# Altium project motordriver-v3.0.PrjPCB
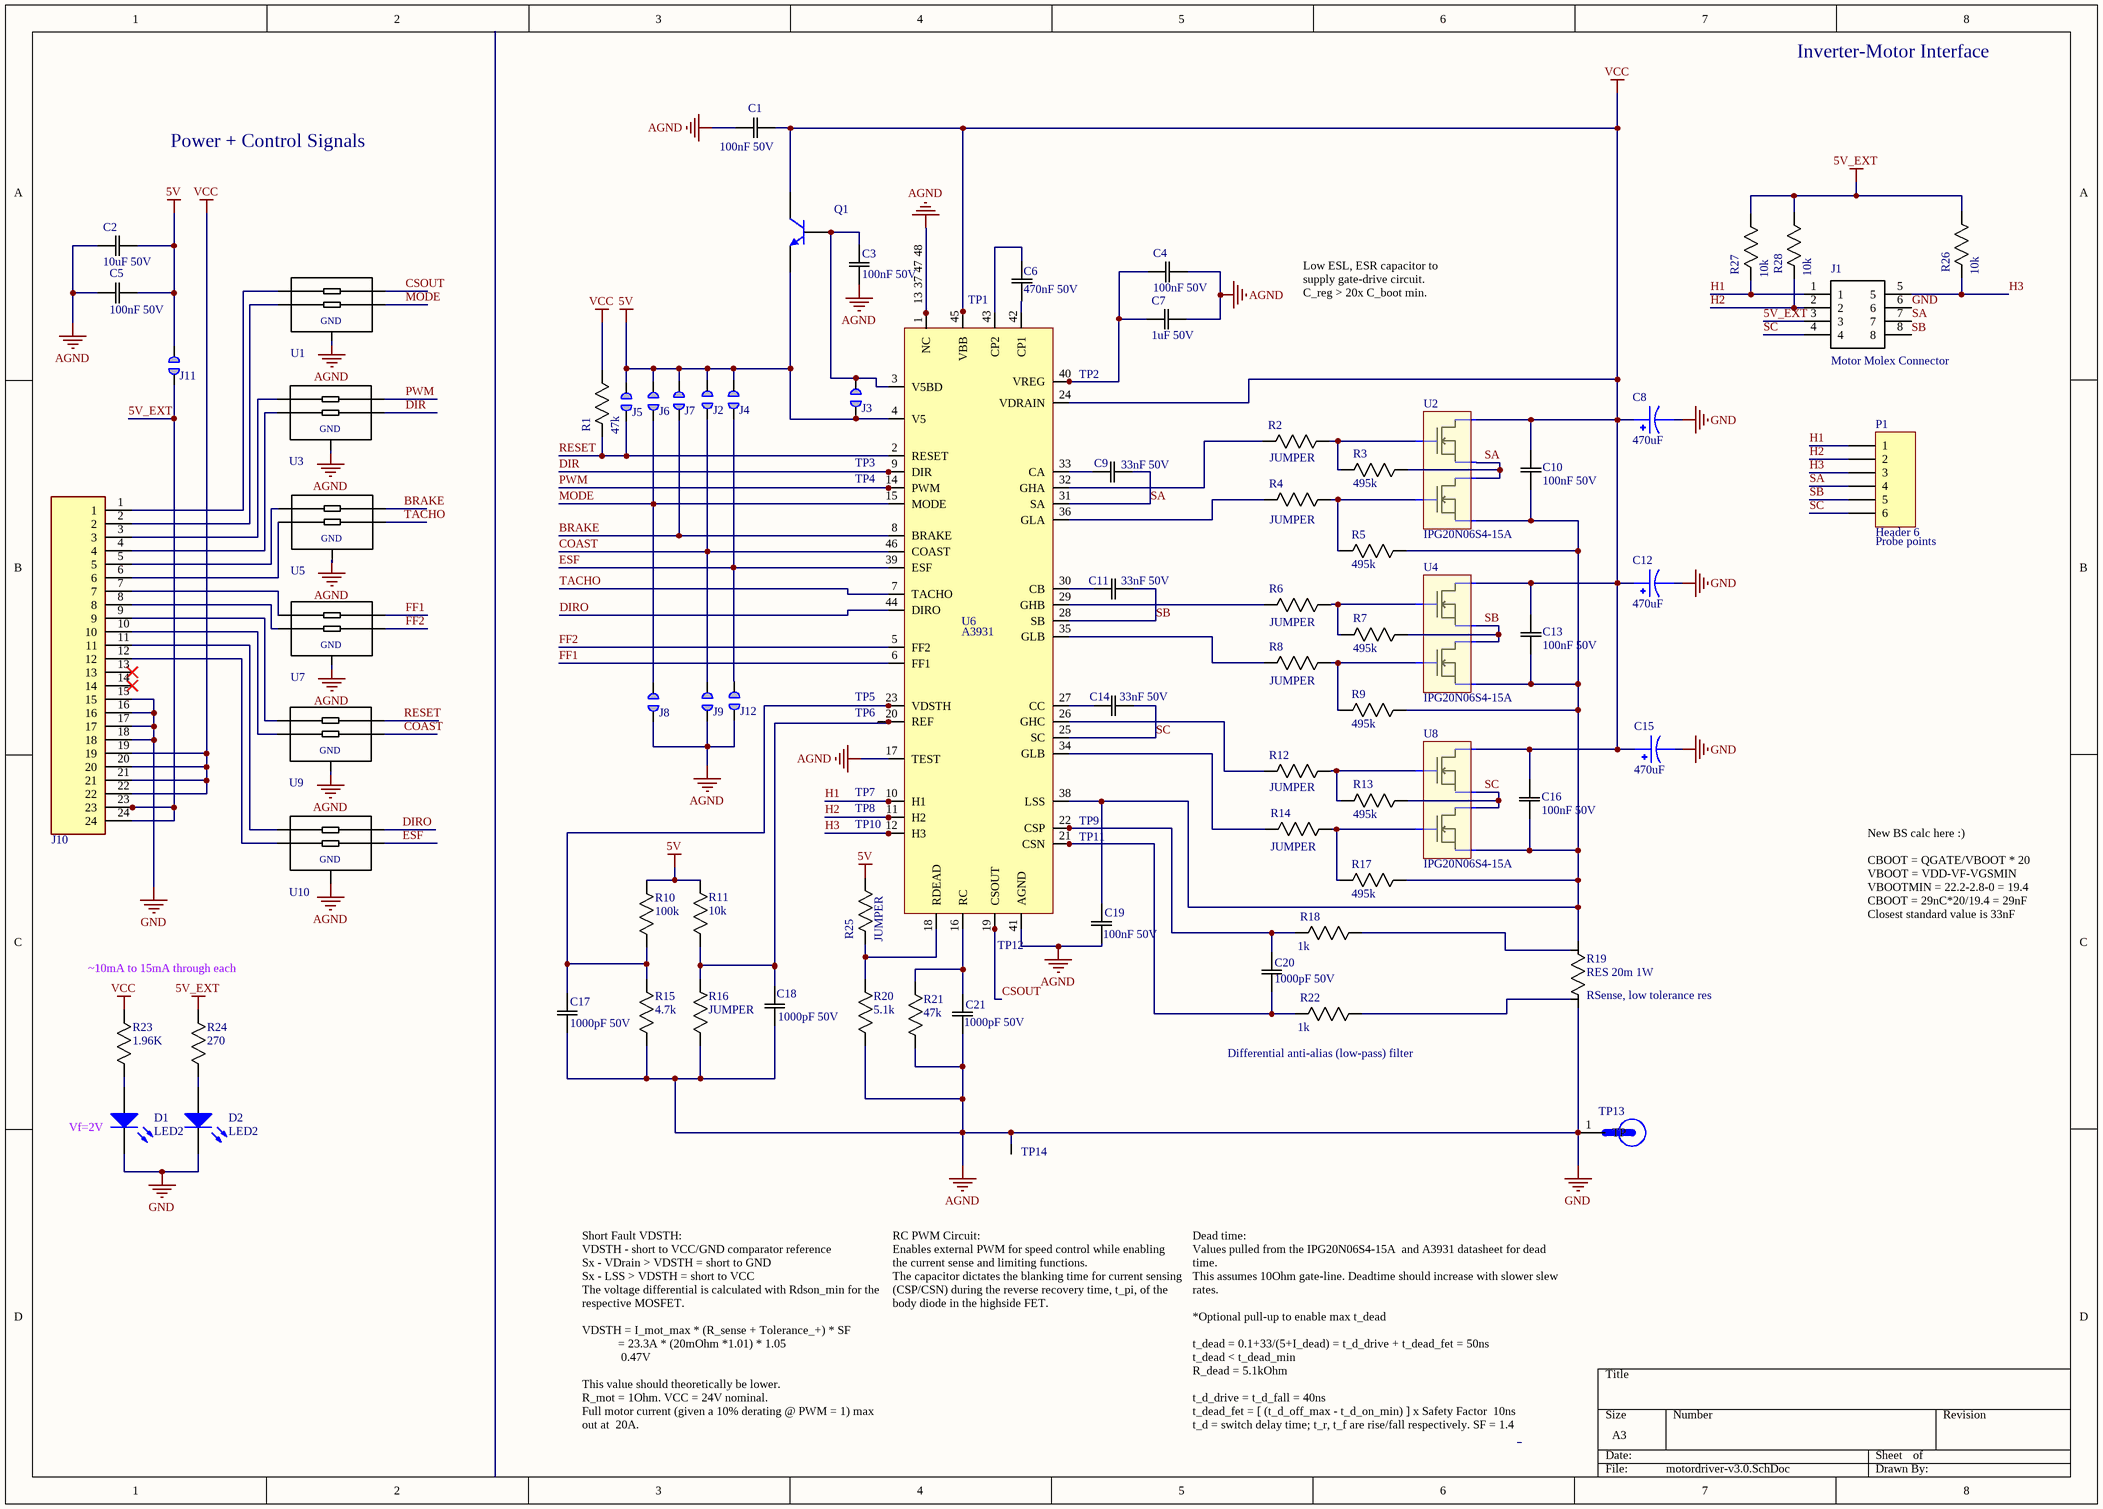
[diagram p0: motordriver-v3.0.SchDoc]
1 sheet, 89 parts. Net scope: global (net labels, ports and power ports of the same name join across sheets).
Board file: motordriver-v3.0.PcbDoc

## Sheet motordriver-v3.0.SchDoc
size A3

### Parts
C1  100nF 50V  [0805]
C2  10uF 50V  [0805]
C3  100nF 50V  [0805]
C4  100nF 50V  [0805]
C5  100nF 50V  [0805]
C6  470nF 50V  [0805]
C7  1uF 50V  [0805]
C8  470uF  [CAPAE1350X1400N_EEV-FK1V471Q]
C9  33nF 50V  [0805]
C10  100nF 50V  [0805]
C11  33nF 50V  [0805]
C12  470uF  [CAPAE1350X1400N_EEV-FK1V471Q]
C13  100nF 50V  [0805]
C14  33nF 50V  [0805]
C15  470uF  [CAPAE1350X1400N_EEV-FK1V471Q]
C16  100nF 50V  [0805]
C17  1000pF 50V  [0805]
C18  1000pF 50V  [0805]
C19  100nF 50V  [0805]
C20  1000pF 50V  [0805]
C21  1000pF 50V  [0805]
D1  LED2  [3.2X1.6X1.1]
D2  LED2  [3.2X1.6X1.1]
J1  Motor Molex Connector  [MOLEX_0039281083]
J2  Jumper (0805 Compatible)  [Solder Jumper]  (value not drawn)
J3  Jumper (0805 Compatible)  [Solder Jumper]  (value not drawn)
J4  Jumper (0805 Compatible)  [Solder Jumper]  (value not drawn)
J5  Jumper (0805 Compatible)  [Solder Jumper]  (value not drawn)
J6  Jumper (0805 Compatible)  [Solder Jumper]  (value not drawn)
J7  Jumper (0805 Compatible)  [Solder Jumper]  (value not drawn)
J8  Jumper (0805 Compatible)  [Solder Jumper]  (value not drawn)
J9  Jumper (0805 Compatible)  [Solder Jumper]  (value not drawn)
J10  CN HDR 24POS 2x12  [CN Header 24 POS (12x2)]  (value not drawn)
J11  Jumper (0805 Compatible)  [Solder Jumper]  (value not drawn)
J12  Jumper (0805 Compatible)  [Solder Jumper]  (value not drawn)
P1  Header 6  [HDR1X6]
Q1  N-BJT BCP54  [*SOT230P700X180-4N]  (value not drawn)
R1  47k  [0805]
R2  JUMPER  [0805]
R3  495k  [0805]
R4  JUMPER  [0805]
R5  495k  [0805]
R6  JUMPER  [0805]
R7  495k  [0805]
R8  JUMPER  [0805]
R9  495k  [0805]
R10  100k  [0805]
R11  10k  [0805]
R12  JUMPER  [0805]
R13  495k  [0805]
R14  JUMPER  [0805]
R15  4.7k  [0805]
R16  JUMPER  [0805]
R17  495k  [0805]
R18  1k  [0805]
R19  RES 20m 1W  [1206 - Sense]
R20  5.1k  [0805]
R21  47k  [0805]
R22  1k  [0805]
R23  1.96K  [0805]
R24  270  [0805]
R25  JUMPER  [0805]
R26  10k  [0805]
R27  10k  [0805]
R28  10k  [0805]
TP1  Test Point (Via)  [TP]  (value not drawn)
TP2  Test Point (Via)  [TP]  (value not drawn)
TP3  Test Point (Via)  [TP]  (value not drawn)
TP4  Test Point (Via)  [TP]  (value not drawn)
TP5  Test Point (Via)  [TP]  (value not drawn)
TP6  Test Point (Via)  [TP]  (value not drawn)
TP7  Test Point (Via)  [TP]  (value not drawn)
TP8  Test Point (Via)  [TP]  (value not drawn)
TP9  Test Point (Via)  [TP]  (value not drawn)
TP10  Test Point (Via)  [TP]  (value not drawn)
TP11  Test Point (Via)  [TP]  (value not drawn)
TP12  Test Point (Via)  [TP]  (value not drawn)
TP13  Test Point - 5019  [TP380X203]  (value not drawn)
TP14  Test Point (Via)  [TP]  (value not drawn)
U1  EMI  [SOT-665]  (value not drawn)
U2  IPG20N06S4-15A  [PG-TDSON-8-10]
U3  EMI  [SOT-665]  (value not drawn)
U4  IPG20N06S4-15A  [PG-TDSON-8-10]
U5  EMI  [SOT-665]  (value not drawn)
U6  A3931  [48-LQFP-EP (7x7)]
U7  EMI  [SOT-665]  (value not drawn)
U8  IPG20N06S4-15A  [PG-TDSON-8-10]
U9  EMI  [SOT-665]  (value not drawn)
U10  EMI  [SOT-665]  (value not drawn)

### Nets
5V: C2.2(C2) C5.2(C2) J2.2 J3.1 J4.2 J5.2 J6.2 J7.2 J11.1 Q1.3(E) R10.1(R1) R11.1(R1) R25.1(R1) U6.4(V5)
5V_EXT: J1.3 J10.23 J10.24 J11.2 R24.1(R1) R26.1(R1) R27.1(R1) R28.1(R1)
GND: C1.1(C1) C2.1(C1) C3.1(C1) C4.2(C2) C5.1(C1) C7.2(C2) C8.2 C12.2 C15.2 C17.1(C1) C18.1(C1) C19.1(C1) C21.1(C1) D1.2(K) D2.2(K) J1.6 J8.1 J9.1 J10.15 J10.16 J10.17 J10.18 J12.1 R15.2(R2) R16.2(R2) R19.2(R2) R20.2(R2) R21.2(R2) TP13.1(TP) TP14.1 U1.2(P$2) U3.2(P$2) U5.2(P$2) U6.1(NC) U6.13 U6.17(TEST) U6.37(NC) U6.41(AGND) U6.47(NC) U6.48(NC) U7.2(P$2) U9.2(P$2) U10.2(P$2)  [also labelled AGND]
VCC: C1.2(C2) C8.1 C10.2(C2) C12.1 C13.2(C2) C15.1 C16.2(C2) J10.19 J10.20 J10.21 J10.22 Q1.2(C) R1.1(R1) R23.1(R1) TP1.1 U2.8(D1) U4.8(D1) U6.24(VDRAIN) U6.45(VBB) U8.8(D1)
BRAKE: J7.1 U5.1(P$1) U6.8(BRAKE)
COAST: J2.1 J9.2 U6.46(COAST) U9.3(P$3)
CSOUT: TP12.1 U1.1(P$1) U6.19(CSOUT)
DIR: TP3.1 U3.3(P$3) U6.9(DIR)
DIRO: U6.44(DIRO) U10.1(P$1)
ESF: J4.1 J12.2 U6.39(ESF) U10.3(P$3)
FF1: U6.6(FF1) U7.1(P$1)
FF2: U6.5(FF2) U7.3(P$3)
H1: J1.1 P1.1 R27.2(R2) TP7.1 U6.10(H1)
H2: J1.2 P1.2 R28.2(R2) TP8.1 U6.11(H2)
H3: J1.5 P1.3 R26.2(R2) TP10.1 U6.12(H3)
MODE: J6.1 J8.2 U1.3(P$3) U6.15(MODE)
PWM: TP4.1 U3.1(P$1) U6.14(PWM)
RESET: J5.1 R1.2(R2) U6.2(RESET) U9.1(P$1)
SA: C9.2(C2) J1.7 P1.4 R3.1(R1) U2.1(S1) U2.6(D2) U6.31(SA)
SB: C11.2(C2) J1.8 P1.5 R7.1(R1) U4.1(S1) U4.6(D2) U6.28(SB)
SC: C14.2(C2) J1.4 P1.6 R13.1(R1) U6.25(SC) U8.1(S1) U8.6(D2)
TACHO: U5.3(P$3) U6.7(TACHO)
NetC3_2: C3.2(C2) J3.2 Q1.1(B) U6.3(V5BD)
NetC4_1: C4.1(C1) C7.1(C1) TP2.1 U6.40(VREG)
NetC6_1: C6.1(C1) U6.42(CP1)
NetC6_2: C6.2(C2) U6.43(CP2)
NetC9_1: C9.1(C1) U6.33(CA)
NetC10_1: C10.1(C1) C13.1(C1) C16.1(C1) C19.2(C2) R5.1(R1) R9.1(R1) R17.1(R1) R19.1(R1) U2.3(S2) U4.3(S2) U6.38(LSS) U8.3(S2)
NetC11_1: C11.1(C1) U6.30(CB)
NetC14_1: C14.1(C1) U6.27(CC)
NetC17_2: C17.2(C2) R10.2(R2) R15.1(R1) TP5.1 U6.23(VDSTH)
NetC18_2: C18.2(C2) R11.2(R2) R16.1(R1) TP6.1 U6.20(REF)
NetC20_1: C20.1(C1) R22.2(R2) TP11.1 U6.21(CSN)
NetC20_2: C20.2(C2) R18.2(R2) TP9.1 U6.22(CSP)
NetC21_2: C21.2(C2) R21.1(R1) U6.16(RC)
NetD1_1: D1.1(A) R23.2(R2)
NetD2_1: D2.1(A) R24.2(R2)
NetJ10_1: J10.1 U1.5(P$5)
NetJ10_2: J10.2 U1.4(P$4)
NetJ10_3: J10.3 U3.5(P$5)
NetJ10_4: J10.4 U3.4(P$4)
NetJ10_5: J10.5 U5.5(P$5)
NetJ10_6: J10.6 U5.4(P$4)
NetJ10_7: J10.7 U7.5(P$5)
NetJ10_8: J10.8 U7.4(P$4)
NetJ10_9: J10.9 U9.5(P$5)
NetJ10_10: J10.10 U9.4(P$4)
NetJ10_11: J10.11 U10.5(P$5)
NetJ10_12: J10.12 U10.4(P$4)
NetR2_1: R2.1(R1) R3.2(R2) U2.2(G1)
NetR2_2: R2.2(R2) U6.32(GHA)
NetR4_1: R4.1(R1) R5.2(R2) U2.4(G2)
NetR4_2: R4.2(R2) U6.36(GLA)
NetR6_1: R6.1(R1) R7.2(R2) U4.2(G1)
NetR6_2: R6.2(R2) U6.29(GHB)
NetR8_1: R8.1(R1) R9.2(R2) U4.4(G2)
NetR8_2: R8.2(R2) U6.35(GLB)
NetR12_1: R12.1(R1) R13.2(R2) U8.2(G1)
NetR12_2: R12.2(R2) U6.26(GHC)
NetR14_1: R14.1(R1) R17.2(R2) U8.4(G2)
NetR14_2: R14.2(R2) U6.34(GLB)
NetR18_1: R18.1(R1) R19.3
NetR19_4: R19.4 R22.1(R1)
NetR20_1: R20.1(R1) R25.2(R2) U6.18(RDEAD)

Not connected (* = marked no-connect by the designer): J10 13* 14*

### Notes on the sheet
- Inverter-Motor Interface
- Power + Control Signals
- Low ESL, ESR capacitor to supply gate-drive circuit.
  C_reg > 20x C_boot min.
- (near P1) Probe points
- New BS calc here :)
  CBOOT = QGATE/VBOOT * 20
  VBOOT = VDD-VF-VGSMIN
  VBOOTMIN = 22.2-2.8-0 = 19.4
  CBOOT = 29nC*20/19.4 = 29nF
  Closest standard value is 33nF
- ~10mA to 15mA through each
- (near R22) Differential anti-alias (low-pass) filter
- (near R19) RSense, low tolerance res
- (near D1) Vf=2V
- Short Fault VDSTH:
  VDSTH - short to VCC/GND comparator reference
  Sx - VDrain > VDSTH = short to GND
  Sx - LSS > VDSTH = short to VCC
  The voltage differential is calculated with Rdson_min for the respective MOSFET.
  VDSTH = I_mot_max * (R_sense + Tolerance_+) * SF
  = 23.3A * (20mOhm *1.01) * 1.05
  0.47V
  This value should theoretically be lower.
  R_mot = 1Ohm. VCC = 24V nominal.
  Full motor current (given a 10% derating @ PWM = 1) max out at  20A.
- RC PWM Circuit:
  Enables external PWM for speed control while enabling
  the current sense and limiting functions.
  The capacitor dictates the blanking time for current sensing
  (CSP/CSN) during the reverse recovery time, t_pi, of the
  body diode in the highside FET.
- Dead time:
  Values pulled from the IPG20N06S4-15A  and A3931 datasheet for dead time.
  This assumes 10Ohm gate-line. Deadtime should increase with slower slew rates.
  *Optional pull-up to enable max t_dead
  t_dead = 0.1+33/(5+I_dead) = t_d_drive + t_dead_fet = 50ns
  t_dead < t_dead_min
  R_dead = 5.1kOhm
  t_d_drive = t_d_fall = 40ns
  t_dead_fet = [ (t_d_off_max - t_d_on_min) ] x Safety Factor  10ns
  t_d = switch delay time; t_r, t_f are rise/fall respectively. SF = 1.4
- 2
- (in symbol EMI FILTER IP4256CZ5-W) GND

### Library data of the parts
C1 C3-C5 C10 C13 C16 C19 = CAP 100nF 50V: CAP CER 0.1UF 50V X7R 0805; Tolerance: 10%; Package: 0805; Value: 100nF; Rating: 50V
C2 C7 = CAP 10uF 50V: CAP CER 10UF 50V X7R; Tolerance: 10%; Package: 1210; Value: 10uF; Rating: 50V; ComponentLink1Description: digikey; ComponentLink1URL: https://www.digikey.ca/en/products/detail/kemet/C1210C106M5RACTU/4918883
C6 = CAP 470nF 50V: CAP CER 0.1UF 50V X7R 0805; Tolerance: 10%; Package: 0805; Value: 470nF; Rating: 50V
C8 C12 C15 = CAP 470uF 35V SMD: 470µF 35V Aluminum Electrolytic Capacitors Radial, Can - SMD 5000 Hrs @ 105°C; MP: EEV-FK1V471Q; MF: Panasonic Electronic; Price: None; Package: Radial Panasonic Electronic
C9 C11 C14 = CAP 33nF 50V: CAP CER 0.033UF 50V X7R 0805; Tolerance: 5%; Package: 0805; Value: 33nF; Rating: 50V; Alt. Value: 33nF
C17 C18 C20 C21 = CAP 1000pF 50V: CAP CER 1000PF 50V X7R 0805; Tolerance: 10%; Alternative value: 1nF; Package: 0805; Value: 1000pF; Rating: 50V; Temperature Coefficient: X7R
D1 D2 = LED GREEN SMD: Typical RED, GREEN, YELLOW, AMBER GaAs LED; Voltage - Forward (Vf) (Typ): 2V; Lens Transparency: Clear; Current - Test: 20mA; Package: 1206; Color: Green
J1 = CN HDR 8POS Motor Molex: Connector Header Through Hole 8 position 0.165" (4.20mm); MP: 0039281083; MF: Molex; Digikey: WM3803-ND; Price: 1.624 CAD; Value: N/A; Digikey Link: https://www.digikey.ca/products/en?keywords=WM3803-ND
J10 = CN HDR 24POS 2x12: Pin Connector 2X12P MOD2 STIFTLEI 24 POS 0.1" 2.54mm
P1 = Header 6: Header, 6-Pin; LatestRevisionDate: 17-Jul-2002; LatestRevisionNote: Re-released for DXP Platform.; Publisher: Altium Limited
Q1 = N-BJT BCP54: TRANS NPN 45V 1A SOT223; MF: Nexperia; MP: BCP54; Digikey PN: 1727-1531-1-ND
R1 R21 = RES 47k 1/8W: RES SMD 47K OHM 1% 1/8W 0805; Power (Watts): 0.125W; Package: 0805; Value: 47k; Tolerance: 1%
R2 R4 R6 R8 R12 R14 R16 R25 = RES 0 1/8W: RES SMD 0 OHM JUMPER 1/8W 0805; Value: 0; Power (Watts): 0.125W; Package: 0805
R3 R5 R7 R9 R13 R17 = RES 495k 0805: RES SMD 499K OHM 1% 1/8W 0805; Manufacturer: Yageo; Manufacturer Part Number: RC0805FR-07499KL; Temperature Coefficient: 100ppm/°C; Voltage Rating (DC): 150V; Resistance: 499kR; Power Rating: 125mW; Supplier 1: Digi-Key; RoHS: Yes; Category: Chip SMD Resistors; Stock 1: 2275; Pricing 1: 1=0.10000, 10=0.04000, 100=0.01630, 1000=0.00731, 2500=0.00635 (USD); Case/Package: 0805; Case Code (Metric): 2012; Case Code (Imperial): 0805; Contact Plating: Tin,Lead,Matte; Min Operating Temperature: -55°C; Max Operating Temperature: 155°C; Termination: SMD/SMT; Composition: Thick Film; Military Standard: Not; Tolerance: 1%; Voltage Rating: 150V; Packaging: Tape and Reel; Length: 2mm; Depth: 1.25mm; Radiation Hardening: No; Lead Free: Lead Free; ComponentLink1URL: https://datasheet.ciiva.com/15189/getdatasheetpartid-326570-15189975.pdf?src-supplier=Verical; ComponentLink1Description: https://datasheet.ciiva.com/15189/getdatasheetpartid-326570-15189975.pdf?src-supplier=Verical; Supplier Part Number 1: 311-499KCRCT-ND
R10 = RES 100k 1/8W: RES SMD 100K OHM 1% 1/8W 0805; Power (Watts): 0.125W; Package: 0805; Value: 100k; Tolerance: 1%
R11 R26-R28 = RES 10k 1/8W: RES SMD 10K OHM 1% 1/8W 0805; Power (Watts): 0.125W; Package: 0805; Value: 10k; Tolerance: 1%
R15 = RES 4.7k 1/8W: RES SMD 4.7k OHM 1% 1/8W 0805; Power (Watts): 0.125W; Package: 0805; Value: 4.7k; Tolerance: 1%
R18 R22 = RES 1k 1/8W: RES SMD 1K OHM 5% 1/8W 0805; Power (Watts): 0.125W; Package: 0805; Value: 1k; Tolerance: 5%
R19 = RES 20m 1W: RES 0.02 OHM 1% 1W 1206
R20 = RES 5.1k 1/8W: RES SMD 5.1K OHM 1% 1/8W 0805; Power (Watts): 0.125W; Package: 0805; Value: 5.1k; Tolerance: 1%
R23 = RES 1.96k 1/8W: RES SMD 1.96K OHM 1% 1/8W 0805; Power (Watts): 0.125W; Package: 0805; Value: 1.96k; Tolerance: 1%
R24 = RES 270 1/8W: RES SMD 270 OHM 5% 1/8W 0805; Power (Watts): 0.125W; Package: 0805; Value: 270; Tolerance: 5%
TP13 = Test Point - 5019: PC Test Point, Miniature Phosphor Bronze, Silver Plating Surface Mount Mounting Type; MP: 5019; MF: Keystone Electronics; Value: *; Package: 2010 Keystone; Digi-Key_Part_Number: 36-5019CT-ND; Digi-Key_Purchase_URL: https://www.digikey.com/product-detail/en/keystone-electronics/5019/36-5019CT-ND/3907344?utm_source=snapeda&utm_medium=aggregator&utm_campaign=symbol
U1 U3 U5 U7 U9 U10 = EMI FILTER IP4256CZ5-W: FILTER RC(PI) 100 OHM/19PF SMD; MF: Nexperia USA Inc.; MP: IP4256CZ5-W,115; SnapEDA_Link: https://www.snapeda.com/parts/IP4256CZ5-W/Nexperia%20USA%20Inc./view-part/3605439/?ref=snap; Price: 0.17 CAD; Package: SOT-665; Digikey: 1727-4718-1-ND; Digikey Link: https://www.digikey.ca/product-detail/en/nexperia-usa-inc/IP4256CZ5-W115/1727-4718-1-ND/2531158
U2 U4 U8 = IPG20N06S4-15A: MOSFET N+N 60V 20A; MF: Infineon Technologies; MF P/N: IPG20N06S4-15A
U6 = A3931_A1: IC MOTOR DRIVER 5.5V-50V 48LQFP - Alternative Symbol; Digikey: 620-1290-1-ND; Digikey Link: https://www.digikey.ca/product-detail/en/allegro-microsystems/A3931KJPTR-T/620-1290-1-ND/2000021

## Assembly variants
Default motordriver-v3.0: not fitted C4 C12 C15 P1 Q1 Q1 R18 R?